# EAGLE design lichten (EAGLE 6.3)
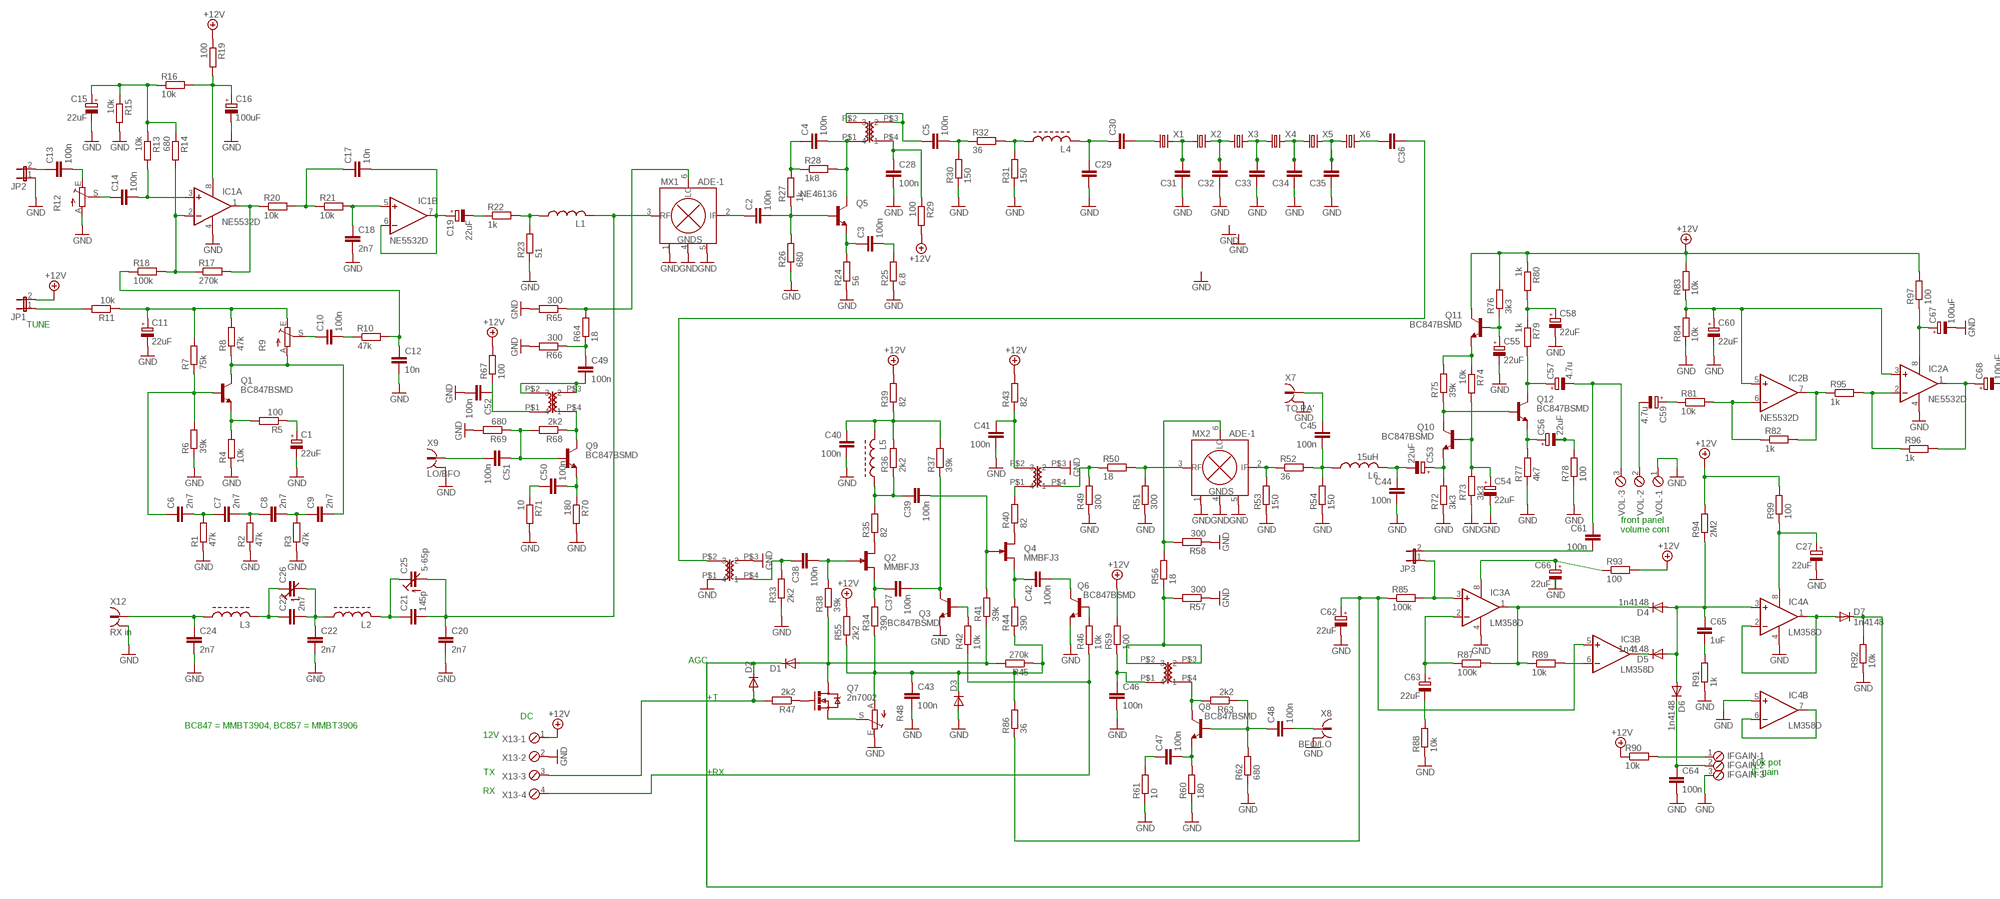
[diagram p0: schematic, sheet 1, part 1 of 2]
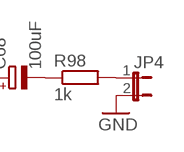
[diagram p1: schematic, sheet 1, part 2 of 2]

## Parts
C1  22uF  CPOL-EUB  [PANASONIC_B]
C2  100n  C-EUC1206K  [C1206K]
C3  100n  C-EUC1206K  [C1206K]
C4  100n  C-EUC1206K  [C1206K]
C5  100n  C-EUC1206K  [C1206K]
C6  2n7  C-EUC1206K  [C1206K]
C7  2n7  C-EUC1206K  [C1206K]
C8  2n7  C-EUC1206K  [C1206K]
C9  2n7  C-EUC1206K  [C1206K]
C10  100n  C-EUC1206K  [C1206K]
C11  22uF  CPOL-EUB  [PANASONIC_B]
C12  10n  C-EUC1206K  [C1206K]
C13  100n  C-EUC1206K  [C1206K]
C14  100n  C-EUC1206K  [C1206K]
C15  22uF  CPOL-EUB  [PANASONIC_B]
C16  100uF  CPOL-EUB  [PANASONIC_B]
C17  10n  C-EUC1206K  [C1206K]
C18  2n7  C-EUC1206K  [C1206K]
C19  22uF  CPOL-EUB  [PANASONIC_B]
C20  2n7  C-EUC1206K  [C1206K]
C21  145p  C-EUC1206K  [C1206K]
C22  2n7  C-EUC1206K  [C1206K]
C23  2n7  C-EUC1206K  [C1206K]
C24  2n7  C-EUC1206K  [C1206K]
C25  5-65p  C-TRIMM3050.505  [CTRIM3050.505]
C26  C-TRIMM3050.505  [CTRIM3050.505]
C27  22uF  CPOL-EUB  [PANASONIC_B]
C28  100n  C-EUC1206K  [C1206K]
C29  C-EUC1206K  [C1206K]
C30  C-EUC1206K  [C1206K]
C31  C-EUC1206K  [C1206K]
C32  C-EUC1206K  [C1206K]
C33  C-EUC1206K  [C1206K]
C34  C-EUC1206K  [C1206K]
C35  C-EUC1206K  [C1206K]
C36  C-EUC1206K  [C1206K]
C37  100n  C-EUC1206K  [C1206K]
C38  100n  C-EUC1206K  [C1206K]
C39  100n  C-EUC1206K  [C1206K]
C40  100n  C-EUC1206K  [C1206K]
C41  100n  C-EUC1206K  [C1206K]
C42  100n  C-EUC1206K  [C1206K]
C43  100n  C-EUC1206K  [C1206K]
C44  100n  C-EUC1206K  [C1206K]
C45  100n  C-EUC1206K  [C1206K]
C46  100n  C-EUC1206K  [C1206K]
C47  100n  C-EUC1206K  [C1206K]
C48  100n  C-EUC1206K  [C1206K]
C49  100n  C-EUC1206K  [C1206K]
C50  100n  C-EUC1206K  [C1206K]
C51  100n  C-EUC1206K  [C1206K]
C52  100n  C-EUC1206K  [C1206K]
C53  22uF  CPOL-EUB  [PANASONIC_B]
C54  22uF  CPOL-EUB  [PANASONIC_B]
C55  22uF  CPOL-EUB  [PANASONIC_B]
C56  22uF  CPOL-EUB  [PANASONIC_B]
C57  4.7u  CPOL-EUB  [PANASONIC_B]
C58  22uF  CPOL-EUB  [PANASONIC_B]
C59  4.7u  CPOL-EUB  [PANASONIC_B]
C60  22uF  CPOL-EUB  [PANASONIC_B]
C61  100n  C-EUC1206K  [C1206K]
C62  22uF  CPOL-EUB  [PANASONIC_B]
C63  22uF  CPOL-EUB  [PANASONIC_B]
C64  100n  C-EUC1206K  [C1206K]
C65  1uF  C-EUC1206K  [C1206K]
C66  22uF  CPOL-EUB  [PANASONIC_B]
C67  100uF  CPOL-EUB  [PANASONIC_B]
C68  100uF  CPOL-EUB  [PANASONIC_B]
D1  DIODE-SOD80C  [SOD80C]
D2  DIODE-SOD80C  [SOD80C]
D3  DIODE-SOD80C  [SOD80C]
D4  1n4148  DIODE-SOD80C  [SOD80C]
D5  1n4148  DIODE-SOD80C  [SOD80C]
D6  1n4148  DIODE-SOD80C  [SOD80C]
D7  1n4148  DIODE-SOD80C  [SOD80C]
IC1  NE5532D  [SO08]
IC2  NE5532D  [SO08]
IC3  LM358D  [SO08]
IC4  LM358D  [SO08]
IFGAIN  MPT3  [3POL254]
JP1  JP1E  [JP1]
JP2  JP1E  [JP1]
JP3  JP1E  [JP1]
JP4  JP1E  [JP1]
L1  L-US6000-XXX-RC  [6000-XXXX-RC]
L2  L-T37-UP  [L-T37-UP]
L3  L-T37-UP  [L-T37-UP]
L4  L-T37-UP  [L-T37-UP]
L5  L-T37-UP  [L-T37-UP]
L6  15uH  L-US6000-XXX-RC  [6000-XXXX-RC]
MX1  ADE-1  [CD636]
MX2  ADE-1  [CD636]
Q1  BC847BSMD  [SOT23]
Q2  MMBFJ3  [SOT23]
Q3  BC847BSMD  [SOT23]
Q4  MMBFJ3  [SOT23]
Q5  NE46136  -NPN-SOT89-BCE  [SOT89-BCE]
Q6  BC847BSMD  [SOT23]
Q7  2n7002  MOSFET-NCHANNELBSS123LT1G  [SOT23]
Q8  BC847BSMD  [SOT23]
Q9  BC847BSMD  [SOT23]
Q10  BC847BSMD  [SOT23]
Q11  BC847BSMD  [SOT23]
Q12  BC847BSMD  [SOT23]
R1  47k  R-EU_M1206  [M1206]
R2  47k  R-EU_M1206  [M1206]
R3  47k  R-EU_M1206  [M1206]
R4  10k  R-EU_M1206  [M1206]
R5  100  R-EU_M1206  [M1206]
R6  39k  R-EU_M1206  [M1206]
R7  75k  R-EU_M1206  [M1206]
R8  47k  R-EU_M1206  [M1206]
R9  TRIM_EU-B25P  [B25P]
R10  47k  R-EU_M1206  [M1206]
R11  10k  R-EU_M1206  [M1206]
R12  TRIM_EU-B25P  [B25P]
R13  10k  R-EU_M1206  [M1206]
R14  680  R-EU_M1206  [M1206]
R15  10k  R-EU_M1206  [M1206]
R16  10k  R-EU_M1206  [M1206]
R17  270k  R-EU_M1206  [M1206]
R18  100k  R-EU_M1206  [M1206]
R19  100  R-EU_M1206  [M1206]
R20  10k  R-EU_M1206  [M1206]
R21  10k  R-EU_M1206  [M1206]
R22  1k  R-EU_M1206  [M1206]
R23  51  R-EU_M1206  [M1206]
R24  56  R-EU_M1206  [M1206]
R25  6.8  R-EU_M1206  [M1206]
R26  680  R-EU_M1206  [M1206]
R27  1k  R-EU_M1206  [M1206]
R28  1k8  R-EU_M1206  [M1206]
R29  100  R-EU_M1206  [M1206]
R30  150  R-EU_M1206  [M1206]
R31  150  R-EU_M1206  [M1206]
R32  36  R-EU_M1206  [M1206]
R33  2k2  R-EU_M1206  [M1206]
R34  390  R-EU_M1206  [M1206]
R35  82  R-EU_M1206  [M1206]
R36  2k2  R-EU_M1206  [M1206]
R37  39k  R-EU_M1206  [M1206]
R38  39k  R-EU_M1206  [M1206]
R39  82  R-EU_M1206  [M1206]
R40  82  R-EU_M1206  [M1206]
R41  39k  R-EU_M1206  [M1206]
R42  10k  R-EU_M1206  [M1206]
R43  82  R-EU_M1206  [M1206]
R44  390  R-EU_M1206  [M1206]
R45  270k  R-EU_M1206  [M1206]
R46  10k  R-EU_M1206  [M1206]
R47  2k2  R-EU_M1206  [M1206]
R48  TRIM_EU-B25P  [B25P]
R49  300  R-EU_M1206  [M1206]
R50  18  R-EU_M1206  [M1206]
R51  300  R-EU_M1206  [M1206]
R52  36  R-EU_M1206  [M1206]
R53  150  R-EU_M1206  [M1206]
R54  150  R-EU_M1206  [M1206]
R55  2k2  R-EU_M1206  [M1206]
R56  18  R-EU_M1206  [M1206]
R57  300  R-EU_M1206  [M1206]
R58  300  R-EU_M1206  [M1206]
R59  100  R-EU_M1206  [M1206]
R60  180  R-EU_M1206  [M1206]
R61  10  R-EU_M1206  [M1206]
R62  680  R-EU_M1206  [M1206]
R63  2k2  R-EU_M1206  [M1206]
R64  18  R-EU_M1206  [M1206]
R65  300  R-EU_M1206  [M1206]
R66  300  R-EU_M1206  [M1206]
R67  100  R-EU_M1206  [M1206]
R68  2k2  R-EU_M1206  [M1206]
R69  680  R-EU_M1206  [M1206]
R70  180  R-EU_M1206  [M1206]
R71  10  R-EU_M1206  [M1206]
R72  3k3  R-EU_M1206  [M1206]
R73  3k3  R-EU_M1206  [M1206]
R74  10k  R-EU_M1206  [M1206]
R75  39k  R-EU_M1206  [M1206]
R76  3k3  R-EU_M1206  [M1206]
R77  4k7  R-EU_M1206  [M1206]
R78  100  R-EU_M1206  [M1206]
R79  1k  R-EU_M1206  [M1206]
R80  1k  R-EU_M1206  [M1206]
R81  10k  R-EU_M1206  [M1206]
R82  1k  R-EU_M1206  [M1206]
R83  10k  R-EU_M1206  [M1206]
R84  10k  R-EU_M1206  [M1206]
R85  100k  R-EU_M1206  [M1206]
R86  36  R-EU_M1206  [M1206]
R87  100k  R-EU_M1206  [M1206]
R88  10k  R-EU_M1206  [M1206]
R89  10k  R-EU_M1206  [M1206]
R90  10k  R-EU_M1206  [M1206]
R91  1k  R-EU_M1206  [M1206]
R92  10k  R-EU_M1206  [M1206]
R93  100  R-EU_M1206  [M1206]
R94  2M2  R-EU_M1206  [M1206]
R95  1k  R-EU_M1206  [M1206]
R96  1k  R-EU_M1206  [M1206]
R97  100  R-EU_M1206  [M1206]
R98  1k  R-EU_M1206  [M1206]
R99  100  R-EU_M1206  [M1206]
TR1  FT2402_TRAFO  [2402_TRAFO]
TR2  FT2402_TRAFO  [2402_TRAFO]
TR3  FT2402_TRAFO  [2402_TRAFO]
TR4  FT2402_TRAFO  [2402_TRAFO]
TR5  FT2402_TRAFO  [2402_TRAFO]
VOL  MPT3  [3POL254]
X1  CRYSTALHC49S  [HC49/S]
X2  CRYSTALHC49S  [HC49/S]
X3  CRYSTALHC49S  [HC49/S]
X4  CRYSTALHC49S  [HC49/S]
X5  CRYSTALHC49S  [HC49/S]
X6  CRYSTALHC49S  [HC49/S]
X7  TO PA'  ST-SMB-V  [ST-SMB-V]
X8  BFO/LO  ST-SMB-V  [ST-SMB-V]
X9  LO/BFO  ST-SMB-V  [ST-SMB-V]
X12  RX in  ST-SMB-V  [ST-SMB-V]
X13  MPT4  [4POL254]

## Nets
+12V: JP1.2 Q11.3(C) R19.1 R29.2 R39.2 R43.2 R55.2 R59.2 R67.2 R76.2 R80.1 R83.2 R90.1 R93.2 R94.2 R97.2 R99.2 X13.1
GND: C1.- C11.- C12.2 C15.- C16.- C18.2 C20.2 C22.2 C24.2 C27.- C28.2 C29.2 C31.1 C32.1 C33.1 C34.1 C35.1 C40.2 C41.2 C43.2 C44.2 C46.2 C52.2 C54.- C55.- C58.- C60.- C62.- C64.2 C66.- C67.- D3.A IC1.4(P:V-) IC2.4(P:V-) IC3.4(P:V-) IC4.4(P:V-) IC4.5(B:+IN) IFGAIN.3 JP2.1 JP4.2 MX1.1(GND) MX1.4(GND) MX1.5(GND) MX2.1(GND) MX2.4(GND) MX2.5(GND) Q3.2(E) Q6.2(E) R1.1 R2.1 R3.1 R4.1 R6.1 R12.A R15.2 R23.1 R24.1 R25.1 R26.1 R30.1 R31.1 R33.1 R48.E R49.1 R51.1 R53.1 R54.1 R57.1 R58.1 R60.1 R61.1 R62.1 R65.2 R66.2 R69.2 R70.2 R71.2 R72.1 R73.1 R77.1 R78.1 R84.1 R88.1 R91.1 R92.1 TR2.P$1 TR2.P$3 TR3.P$3 VOL.1 X7.2 X7.3 X7.4 X7.5 X8.2 X8.3 X8.4 X8.5 X9.2 X9.3 X9.4 X9.5 X12.2 X12.3 X12.4 X12.5 X13.2
N$1: C20.1 C21.2 C25.2(A) L1.2 MX1.3(RF)
N$2: C21.1 C25.1(E) L2.2
N$3: C22.1 C23.2 C26.2(A) L2.1
N$4: Q1.2(E) R4.2 R5.2
N$5: C1.+ R5.1
N$6: C9.2 Q1.3(C) R8.1 R9.A
N$7: C8.2 C9.1 R3.2
N$8: C7.2 C8.1 R2.2
N$9: C6.2 C7.1 R1.2
N$10: C6.1 Q1.1(B) R6.2 R7.1
N$11: C11.+ R7.2 R8.2 R9.E R11.1
N$12: C10.1 R9.S
N$13: C10.2 R10.1
N$14: C14.1 R12.S
N$15: JP1.1 R11.2
N$16: C12.1 R10.2 R18.1
N$17: C13.2 R12.E
N$18: C14.2 IC1.3(A:+IN) R13.2
N$19: C15.+ R13.1 R14.1 R15.1 R16.1
N$20: IC1.2(A:-IN) R14.2 R17.1 R18.2
N$21: C23.1 C26.1(E) L3.2
N$22: IC1.1(A:OUT) R17.2 R20.1
N$23: C30.2 X1.1
N$24: C13.1 JP2.2
N$25: C24.1 L3.1 X12.1
N$26: C2.1 MX1.2(IF)
N$27: C16.+ IC1.8(P:V+) R16.2 R19.2
N$28: C17.1 R20.2 R21.1
N$29: C18.1 IC1.5(B:+IN) R21.2
N$30: C17.2 C19.+ IC1.6(B:-IN) IC1.7(B:OUT)
N$31: C2.2 Q5.B R26.2 R27.1
N$32: C19.- R22.1
N$33: L1.1 R22.2 R23.2
N$34: C3.1 Q5.E R24.2
N$35: C4.2 Q5.C R28.2 TR1.P$1
N$36: C4.1 R27.2 R28.1
N$37: C5.1 TR1.P$2 TR1.P$3
N$38: C3.2 R25.2
N$39: C28.1 R29.1 TR1.P$4
N$40: C5.2 R30.2 R32.1
N$41: L4.1 R31.2 R32.2
N$42: C29.1 C30.1 L4.2
N$43: C31.2 X1.2 X2.1
N$44: C32.2 X2.2 X3.1
N$45: C33.2 X3.2 X4.1
N$46: C34.2 X4.2 X5.1
N$47: C35.2 X5.2 X6.1
N$48: C38.1 R33.2 TR2.P$4
N$49: C36.2 X6.2
N$50: C37.1 Q2.2(S) R34.2
N$51: Q2.1(D) R35.1
N$52: C39.1 L5.1 R35.2 R36.1
N$53: C38.2 Q2.3(G) R38.2
N$54: C40.1 L5.2 R36.2 R37.2 R39.1
N$55: C37.2 Q3.3(C) R37.1
N$56: C36.1 TR2.P$2
N$57: C39.2 Q4.3(G) R41.2
N$58: Q4.1(D) R40.1
N$59: Q3.1(B) R42.2
N$60: D1.A Q7.3(D) R38.1 R41.1 R45.2
N$61: R40.2 TR3.P$1
N$62: C41.1 R43.1 TR3.P$2
N$63: C42.1 Q4.2(S) R44.2
N$64: C42.2 Q6.3(C)
N$65: C68.+ IC2.1(A:OUT) R96.2
N$66: C43.1 D3.C R34.1 R44.1 R45.1 R48.A R55.1 R86.2
N$67: Q6.1(B) R46.2
N$68: R42.1 R46.1 X13.4
N$69: Q7.1(G) R47.1
N$70: D2.A R47.2 X13.3
N$71: Q7.2(S) R48.S
N$72: R49.2 R50.1 TR3.P$4
N$73: MX2.3(RF) R50.2 R51.2
N$74: MX2.2(IF) R52.1 R53.2
N$75: C45.2 L6.1 R52.2 R54.2
N$76: C44.1 C53.- L6.2
N$77: C45.1 X7.1
N$78: C54.+ Q10.1(B) R73.2 R74.2
N$79: MX2.6(LO) R56.2 R58.2
N$80: R56.1 R57.2 TR4.P$2 TR4.P$3
N$81: Q8.3(C) R63.2 TR4.P$4
N$82: C46.1 R59.1 TR4.P$1
N$83: C47.2 Q8.2(E) R60.2
N$84: C48.1 Q8.1(B) R62.2 R63.1
N$85: C47.1 R61.2
N$86: C48.2 X8.1
N$87: Q9.3(C) R68.1 TR5.P$4
N$88: C49.2 TR5.P$2 TR5.P$3
N$89: C49.1 R64.1 R66.1
N$90: MX1.6(LO) R64.2 R65.1
N$91: C52.1 R67.1 TR5.P$1
N$92: C51.1 Q9.1(B) R68.2 R69.1
N$93: C50.1 R71.1
N$94: C50.2 Q9.2(E) R70.1
N$95: C51.2 X9.1
N$96: C53.+ Q10.2(E) R72.2
N$97: C56.- R78.2
N$98: Q10.3(C) Q12.1(B) R75.1
N$99: Q11.2(E) R74.1 R75.2
N$100: C55.+ Q11.1(B) R76.1
N$101: C67.+ IC2.8(P:V+) R97.1
N$102: C56.+ Q12.2(E) R77.2
N$103: C57.+ Q12.3(C) R79.2
N$104: C58.+ R79.1 R80.2
N$105: C57.- C61.1 VOL.3
N$106: IC2.6(B:-IN) R81.2 R82.1
N$107: C59.- VOL.2
N$108: IC2.7(B:OUT) R82.2 R95.1
N$109: C59.+ R81.1
N$110: C60.+ IC2.3(A:+IN) IC2.5(B:+IN) R83.1 R84.2
N$111: C62.+ IC3.5(B:+IN) R85.1 R86.1
N$112: C63.- R88.2
N$113: C61.2 JP3.2
N$114: C63.+ IC3.2(A:-IN) R87.1
N$115: D4.C IC3.1(A:OUT) R87.2 R89.1
N$116: IC3.6(B:-IN) R89.2
N$117: C68.- R98.1
N$118: D5.C IC3.7(B:OUT)
N$119: C65.1 D4.A D5.A D6.A IC4.3(A:+IN) R94.1
N$120: IFGAIN.1 R90.2
N$121: C64.1 D6.C IFGAIN.2
N$122: C65.2 R91.2
N$123: D7.A IC4.1(A:OUT) IC4.2(A:-IN)
N$124: D1.C D2.C D7.C R92.2
N$125: C66.+ R93.1
N$126: IC4.6(B:-IN) IC4.7(B:OUT)
N$128: IC2.2(A:-IN) R95.2 R96.1
N$129: IC3.3(A:+IN) JP3.1 R85.2
N$133: JP4.1 R98.2
N$134: IC3.8(P:V+)
N$135: C27.+ IC4.8(P:V+) R99.1

## Notes on the sheet
- TUNE
- front panel
  volume cont
- AGC
- +T
- DC
- BC847 = MMBT3904, BC857 = MMBT3906
- 12V
- TX | +RX
- 10k pot
  IF gain
- RX

## Library data of the parts
C1 C11 C15 C16 C19 C27 C53-C60 C62 C63 C66-C68 = rcl:CPOL-EU: POLARIZED CAPACITOR, European symbol
C2-C10 C12-C14 C17 C18 C20-C24 C28-C52 C61 C64 C65 = rcl:C-EU: CAPACITOR, European symbol
C25 C26 = rcl:C-TRIMM: Trimm capacitor
D1-D7 = diode:DIODE-: DIODE
IC1 IC2 = linear:NE5532: AUDIO AMPLIFIER
IC3 IC4 = linear:LM358: OP AMP also LM158; LM258; LM2904 Source: http://cache.national.com/ds/LM/LM158.pdf
IFGAIN VOL = con-phoenix-254:MPT3: PHOENIX CONNECTOR; OC_FARNELL: unknown; OC_NEWARK: unknown
JP1-JP4 = jumper:JP1E: JUMPER
L1 L6 = rcl:L-US: INDUCTOR, American symbol
L2-L5 = yhf_spec:L-T37-UP
MX1 MX2 = minickts:ADE-1: ADE-1 & ADE-1+ Level 7 Mixer, 0.5 - 500 MHz
Q1 Q3 Q6 Q8-Q12 = transistor-npn:BC847*: NPN Transistor
Q2 Q4 = transistor-small-signal:MMBFJ3*: N-Channel RF Amplifier Source: http://www.fairchildsemi.com/pf/J3/J310.html
Q5 = transistor:*-NPN-: NPN Transistror BF959 corrected 2008.03.06
Q7 = SparkFun-DiscreteSemi:MOSFET-NCHANNEL: Common NMOSFET Parts MFG P/N Store ID Prod ID FDD8780 TRANS-09984 SI7820DN TRANS-11055 FDS6630A IC-08089 2N7002PW TRANS-11151 FQP30N06L COM-10213 TRANS-10060 BSS123LT1G TRANS-08345 BSS138 TRANS-00830 BS170 2N7000; PROD_ID: TRANS-08345
R1-R8 R10 R11 R13-R47 R49-R99 = rcl:R-EU_: RESISTOR, European symbol
R9 R12 R48 = pot:TRIM_EU-: POTENTIOMETER
TR1-TR5 = ref-packages:FT2402_TRAFO
X1-X6 = crystal:CRYSTAL: CRYSTAL; OC_FARNELL: 1667008; OC_NEWARK: unknown
X7-X9 X12 = con-coax:ST-SMB-V: MALE SMB CONNECTOR Radiall distributor RS 193-8855G7; OC_FARNELL: unknown; OC_NEWARK: unknown
X13 = con-phoenix-254:MPT4: PHOENIX CONNECTOR; OC_FARNELL: unknown; OC_NEWARK: unknown

## Board
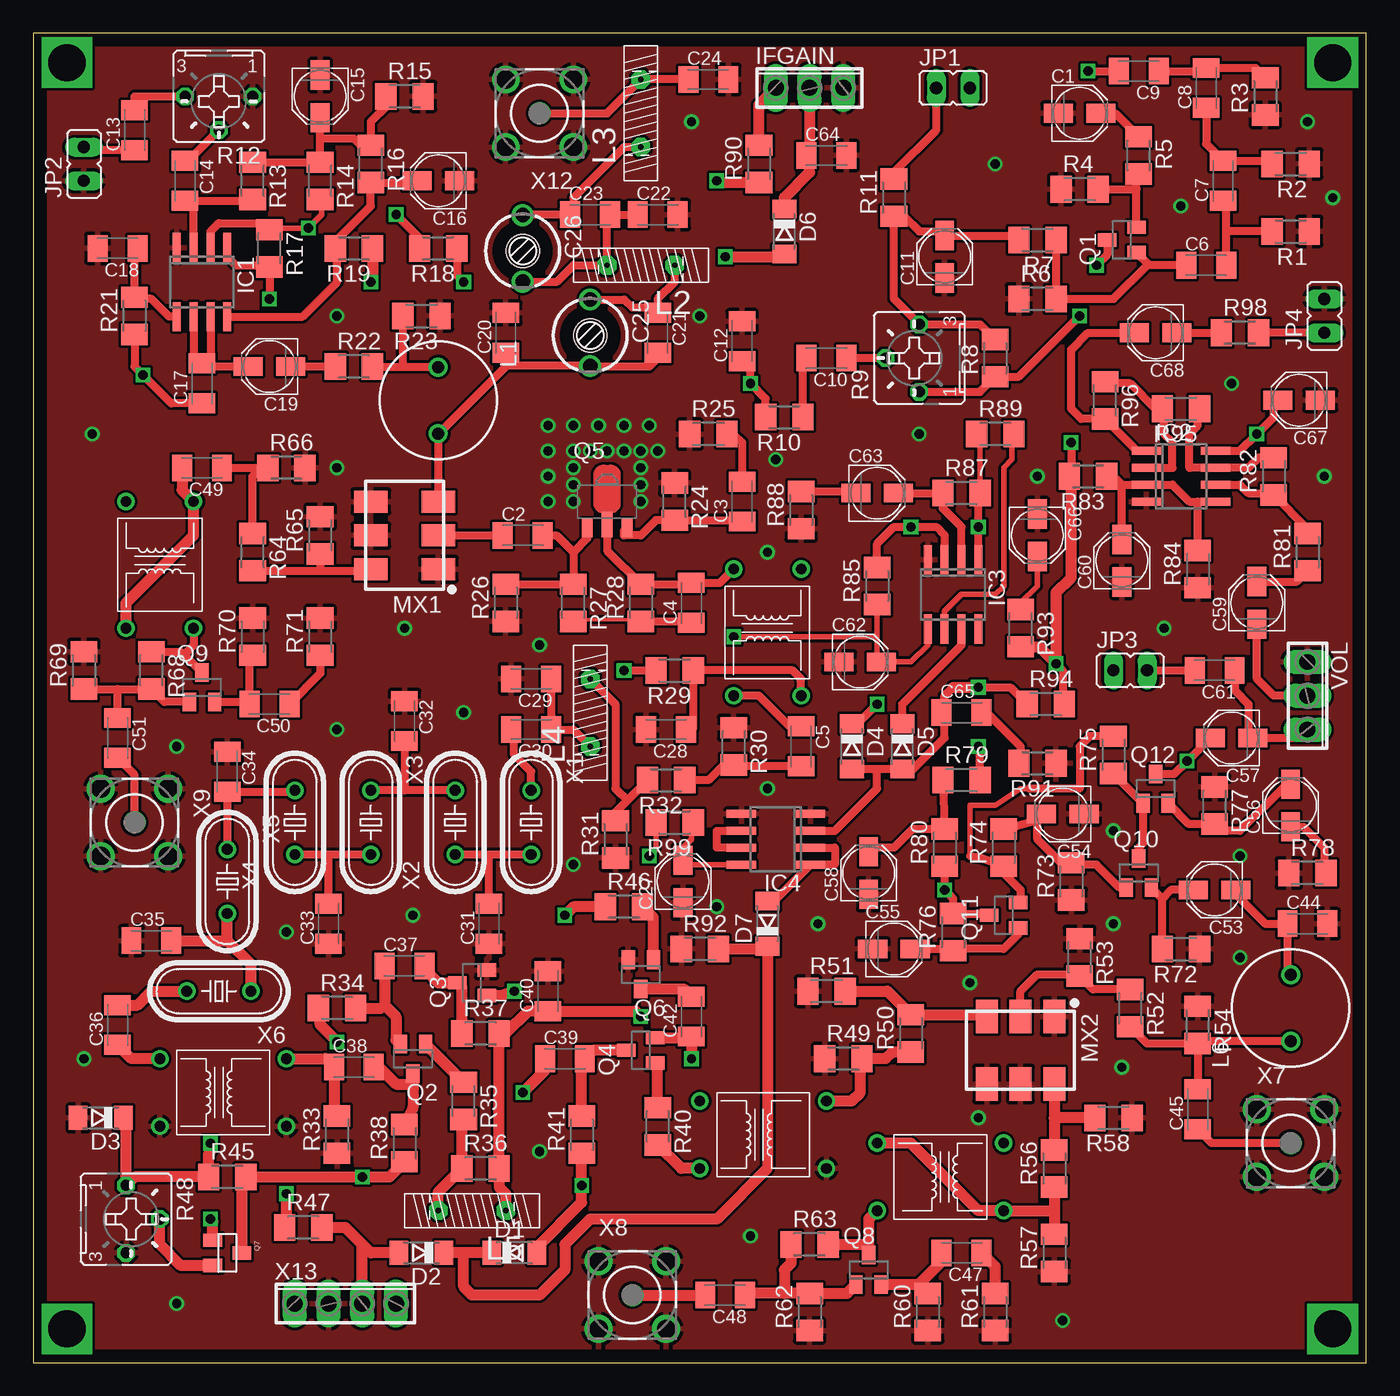
[diagram p2: board, top side]
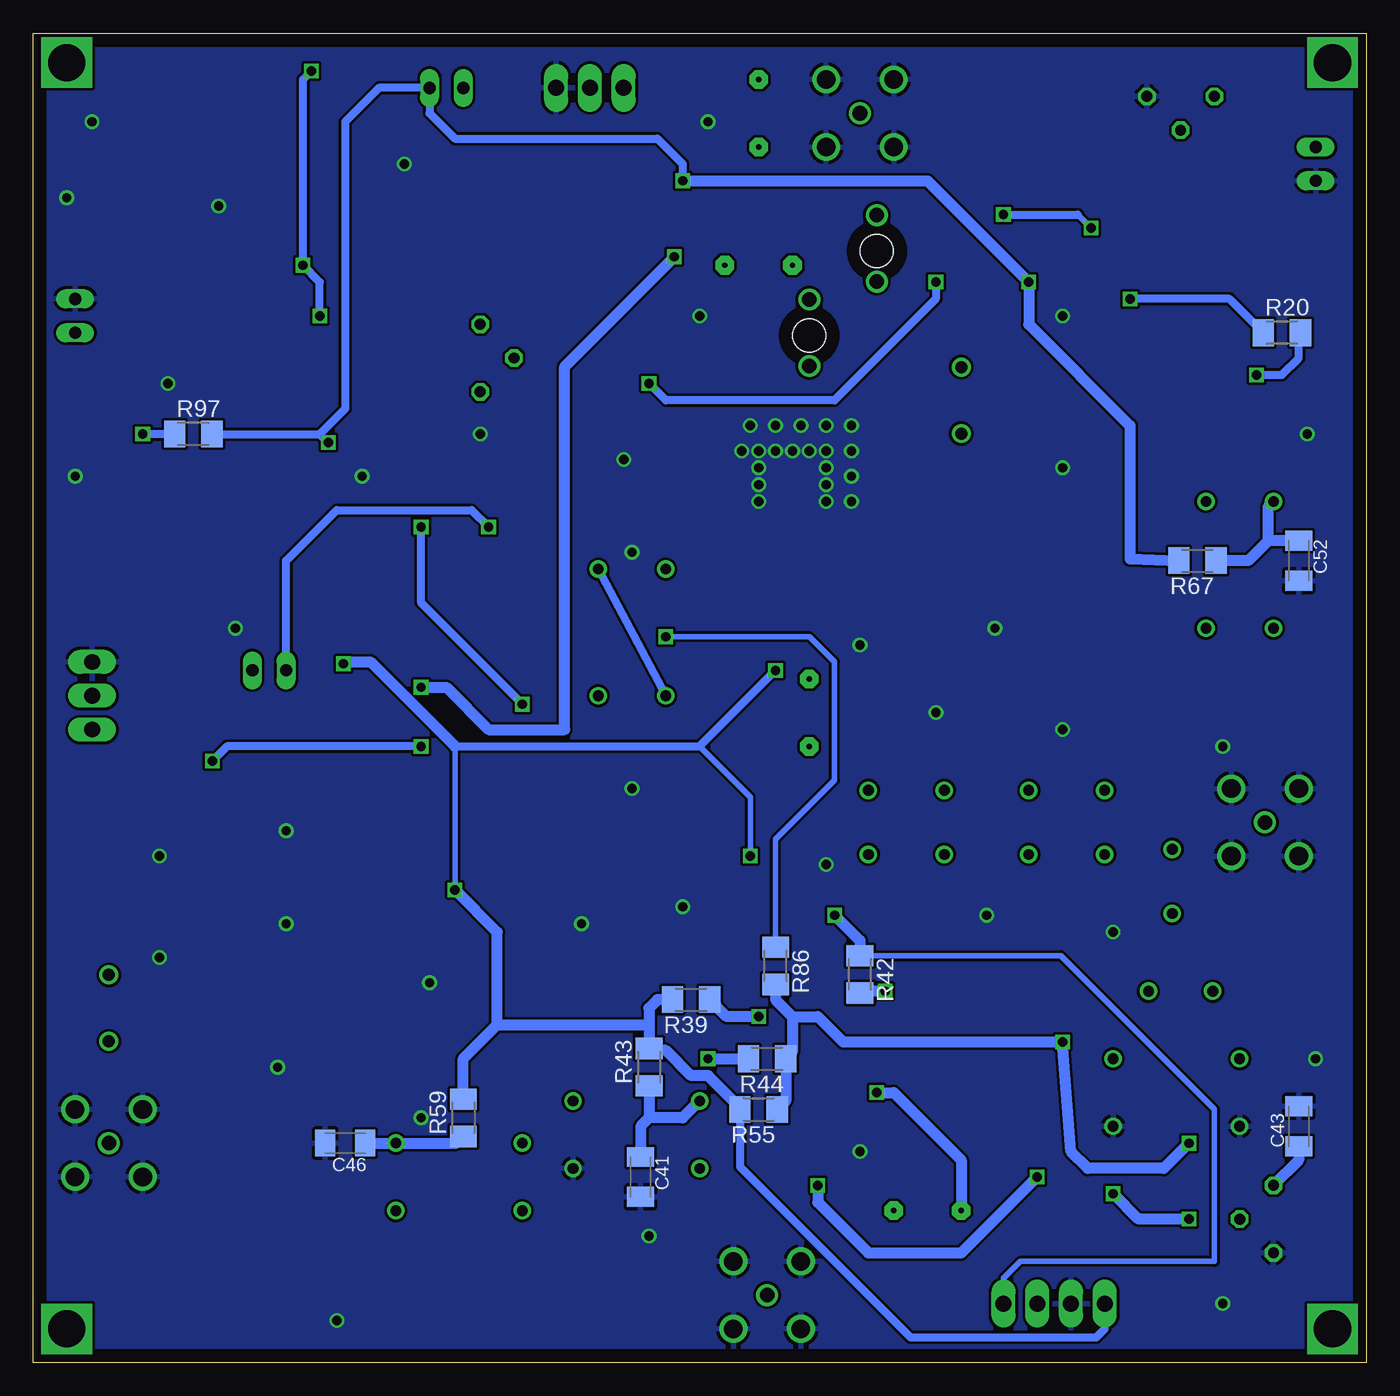
[diagram p3: board, bottom side, seen from below]

Size 100.31 x 100 mm. Coordinates in mm from the lower left corner, seen from the top.
Outline: 0,0 100.31,0 100.31,100 0,100 0,0
Copper layers (1*16): Top 0.035mm / dielectric 1.5mm / Bottom 0.035mm
Design rules "default": minimum track width 10mil, minimum drill 24mil, track to track 8mil, track to pad 8mil, pad to pad 8mil, via to via 8mil, smd to smd 8mil, copper to edge 40mil, drill to drill 8mil, minimum pad ring 10mil, minimum via ring 8mil, stop-mask expansion 4mil, vias tented up to drill 0mil, thermal gap 10mil

### Footprints (pad centres in the part's own frame; a part is rotated, then mirrored left to right if it is on the bottom)
PANASONIC_B = smd 2.2 x 1.4: + 1.6,0; - -1.6,0
C1206K = smd 1.5 x 2: 1 -1.5,0; 2 1.5,0
CTRIM3050.505 = drill 1.1: 1 -2.5,0; 2 2.5,0 | hole 2.5: 0.2,0
SOD80C = smd 1.4 x 1.8: A 1.7,0; C -1.7,0
SO08 = smd 0.6 x 2.2: 1 -1.905,-2.6; 2 -0.635,-2.6; 3 0.635,-2.6; 4 1.905,-2.6; 5 1.905,2.6; 6 0.635,2.6; 7 -0.635,2.6; 8 -1.905,2.6
3POL254 = drill 1.2 long: 1 -2.54,0; 2 0,0; 3 2.54,0
JP1 = drill 0.914 long: 1 0,-1.27; 2 0,1.27
6000-XXXX-RC = drill 0.9 pad 1.422: 1 -2.5,0; 2 2.5,0
L-T37-UP = drill 0.406 pad 1.397 octagon: 1 2.54,0; 2 -2.54,0
CD636 = smd 1.651 x 2.54: 1 -2.54,-2.54; 2 0,-2.54; 3 2.54,-2.54; 4 2.54,2.54; 5 0,2.54; 6 -2.54,2.54
SOT23 = smd 1 x 1.4: 1 -0.95,-1.1; 2 0.95,-1.1; 3 0,1.1
SOT89-BCE = smd 0.8 x 1.4: B -1.499,-1.981; E 1.499,-1.981 | smd 0.8 x 1.9: C 0,-1.727
M1206 = smd 1.6 x 2: 1 -1.4,0; 2 1.4,0
B25P = drill 0.813 octagon: A -2.54,0; E 2.54,0; S 0,2.54
2402_TRAFO = drill 0.8: P$1 -1.27,0.635; P$2 -1.27,5.715; P$3 8.255,0.635; P$4 8.255,5.715
HC49/S = drill 0.813: 1 -2.413,0; 2 2.413,0
ST-SMB-V = drill 1.1: 1 0,0 | drill 1.4: 2 -2.54,2.54; 3 2.54,2.54; 4 2.54,-2.54; 5 -2.54,-2.54
4POL254 = drill 1.2 long: 1 -3.81,0; 2 -1.27,0; 3 1.27,0; 4 3.81,0

### Placement (x,y rotation side)
C1  78.74,93.98 0 top
C2  36.83,62.23 0 top
C3  53.34,64.77 90 top
C4  49.53,57.15 90 top
C5  57.78,46.35 270 top
C6  88.27,82.55 0 top
C7  89.53,88.9 90 top
C8  88.27,95.89 90 top
C9  83.19,97.16 180 top
C10  59.69,75.56 180 top
C11  68.58,83.19 90 top
C12  53.34,76.83 90 top
C13  7.62,92.71 90 top
C14  11.43,88.9 270 top
C15  21.59,95.25 270 top
C16  30.48,88.9 180 top
C17  12.7,73.66 90 top
C18  6.35,83.82 180 top
C19  17.78,74.93 180 top
C20  35.56,77.47 90 top
C21  46.99,77.47 270 top
C22  46.99,86.36 0 top
C23  41.91,86.36 0 top
C24  50.8,96.52 0 top
C25  41.91,77.47 270 top
C26  36.83,83.82 270 top
C27  48.9,36.2 90 top
C28  47.62,47.62 180 top
C29  37.47,51.44 180 top
C30  37.47,47.62 180 top
C31  34.29,33.02 90 top
C32  27.94,48.26 270 top
C33  22.23,33.02 90 top
C34  14.61,44.45 270 top
C35  8.89,31.75 0 top
C36  6.35,25.4 90 top
C37  27.94,29.84 0 top
C38  24.13,22.23 0 top
C39  40.01,22.86 0 top
C40  38.73,27.94 90 top
C41  54.61,13.97 270 bottom
C42  49.53,26.04 90 top
C43  5.08,17.78 90 bottom
C44  95.89,33.02 0 top
C45  87.63,19.05 90 top
C46  76.83,16.51 180 bottom
C47  69.85,8.26 180 top
C48  52.07,5.08 180 top
C49  12.7,67.31 180 top
C50  17.78,49.53 180 top
C51  6.35,46.99 270 top
C52  5.08,60.33 270 bottom
C53  88.9,35.56 180 top
C54  77.47,41.27 180 top
C55  64.77,31.11 0 top
C56  94.61,41.91 90 top
C57  90.17,46.99 180 top
C58  62.87,36.83 90 top
C59  92.08,57.15 90 top
C60  81.92,60.33 90 top
C61  88.9,52.07 180 top
C62  62.23,52.7 0 top
C63  63.5,65.41 0 top
C64  59.69,90.81 0 top
C65  69.85,48.9 0 top
C66  75.56,62.23 270 top
C67  95.25,72.39 180 top
C68  84.45,77.47 180 top
D1  36.2,8.26 0 top
D2  29.21,8.26 180 top
D3  5.08,18.41 180 top
D4  61.59,46.35 270 top
D5  65.41,46.35 270 top
D6  56.52,85.09 270 top
D7  55.24,33.02 90 top
IC1  12.7,81.28 180 top
IC2  86.36,66.67 270 top
IC3  69.22,57.78 180 top
IC4  55.88,39.37 90 top
IFGAIN  58.42,95.89 0 top
JP1  69.22,95.89 270 top
JP2  3.81,90.17 0 top
JP3  82.55,52.07 270 top
JP4  97.16,78.74 0 top
L1  30.48,72.39 270 top
L2  45.72,82.55 180 top
L3  45.72,93.98 90 top
L4  41.91,48.9 90 top
L5  33.02,11.43 180 top
L6  94.61,26.67 90 top
MX1  27.94,62.23 90 top
MX2  74.3,23.5 180 top
Q1  81.92,84.45 90 top
Q2  28.57,22.86 180 top
Q3  33.02,28.57 90 top
Q4  45.72,23.5 90 top
Q5  43.18,64.77 0 top
Q6  45.72,29.21 180 top
Q7  14.61,8.26 270 top
Q8  62.87,6.99 0 top
Q9  12.7,50.8 0 top
Q10  83.19,36.83 0 top
Q11  73.03,33.66 90 top
Q12  84.45,43.18 0 top
R1  94.61,85.09 180 top
R2  94.61,90.17 180 top
R3  92.71,95.25 90 top
R4  78.74,88.27 0 top
R5  83.19,90.81 270 top
R6  75.56,80.01 0 top
R7  75.56,84.45 180 top
R8  72.39,75.56 90 top
R9  66.67,75.56 90 top
R10  56.52,71.12 180 top
R11  64.77,87.63 90 top
R12  13.97,95.25 180 top
R13  16.51,88.9 270 top
R14  21.59,88.9 270 top
R15  27.94,95.25 0 top
R16  25.4,90.17 270 top
R17  17.78,83.82 270 top
R18  30.48,83.82 180 top
R19  24.13,83.82 180 top
R20  6.35,77.47 0 bottom
R21  7.62,78.74 90 top
R22  24.13,74.93 0 top
R23  29.21,78.74 180 top
R24  48.26,64.77 270 top
R25  50.8,69.85 0 top
R26  35.56,57.15 90 top
R27  40.64,57.15 270 top
R28  45.72,57.15 90 top
R29  48.26,52.07 180 top
R30  52.7,46.35 270 top
R31  43.81,39.37 90 top
R32  47.62,43.81 180 top
R33  22.86,17.14 90 top
R34  22.86,26.67 0 top
R35  32.38,19.68 270 top
R36  33.66,14.61 0 top
R37  33.66,24.77 0 top
R38  27.94,16.51 90 top
R39  50.8,27.3 180 bottom
R40  46.99,17.78 270 top
R41  41.27,17.14 90 top
R42  38.1,29.21 270 bottom
R43  53.98,22.23 90 bottom
R44  45.09,22.86 180 bottom
R45  14.61,13.97 0 top
R46  44.45,34.29 0 top
R47  20.32,10.16 0 top
R48  6.99,10.79 270 top
R49  60.96,22.86 0 top
R50  66.04,24.77 90 top
R51  59.69,27.94 0 top
R52  82.55,26.67 270 top
R53  78.74,30.48 270 top
R54  87.63,25.4 270 top
R55  45.72,19.05 180 bottom
R56  76.83,14.61 90 top
R57  76.83,8.26 90 top
R58  81.28,18.41 180 top
R59  67.94,18.41 90 bottom
R60  67.31,3.81 90 top
R61  72.39,3.81 90 top
R62  58.42,3.81 90 top
R63  58.42,8.89 0 top
R64  16.51,60.96 270 top
R65  21.59,62.23 90 top
R66  19.05,67.31 0 top
R67  12.7,60.33 180 bottom
R68  8.89,52.07 270 top
R69  3.81,52.07 90 top
R70  16.51,54.61 90 top
R71  21.59,54.61 90 top
R72  86.36,31.11 180 top
R73  78.11,36.2 90 top
R74  73.03,38.73 90 top
R75  81.28,45.72 90 top
R76  69.22,32.38 90 top
R77  88.9,41.91 270 top
R78  95.89,36.83 0 top
R79  69.85,43.81 0 top
R80  68.58,38.73 90 top
R81  95.89,60.96 90 top
R82  93.34,66.67 90 top
R83  79.38,66.67 180 top
R84  87.63,59.69 90 top
R85  63.5,58.42 90 top
R86  44.45,29.84 270 bottom
R87  69.85,65.41 0 top
R88  57.78,64.14 90 top
R89  72.39,69.85 0 top
R90  54.61,90.17 90 top
R91  75.56,45.09 180 top
R92  50.16,31.11 0 top
R93  74.3,55.24 270 top
R94  76.2,49.53 0 top
R95  86.36,71.75 180 top
R96  80.64,72.39 270 top
R97  88.27,69.85 0 bottom
R98  90.81,77.47 0 top
R99  48.26,40.64 180 top
TR1  52.07,58.42 270 top
TR2  10.79,17.14 0 top
TR3  51.44,13.97 0 top
TR4  71.75,17.14 180 top
TR5  6.35,63.5 270 top
VOL  95.89,50.16 270 top
X1  37.47,40.64 270 top
X2  31.75,40.64 90 top
X3  25.4,40.64 270 top
X4  19.68,40.64 90 top
X5  14.61,36.2 270 top
X6  13.97,27.94 180 top
X7  94.61,16.51 0 top
X8  45.09,5.08 0 top
X9  7.62,40.64 270 top
X12  38.1,93.98 180 top
X13  23.5,4.45 0 top

### Tracks (layer width: path | path; a pad name or v marks a point on that pad's centre or on a via)
+12V  (via drill 0.7)
  Top 0.406: R99.2 46.86,38.6 v46.35,38.1
  Top 0.61: Q11.3 71.16,33.78 R76.2 69.22,34.92 v68.58,35.56 R80.1 | v76.97,52.58 77.47,52.07 77.47,49.66 R94.2 | v78.11,69.22 78.11,66.81 R83.2 | v44.45,52.07 R29.2
  Top 0.813: R19.1 25.53,81.41 v25.4,81.28 | R90.1 51.56,88.77 v51.44,88.9 | R83.2 78.11,66.55 78.11,59.05 76.97,57.91 v76.97,52.58 76.83,52.7 75.69,53.84 R93.2
  Bottom 0.406: v68.58,35.56 68.58,46.35 | 76.83,52.7 v76.97,52.58 | v46.35,38.1 46.35,42.55 50.16,46.35
  Bottom 0.61: R97.2 78.74,69.85 | 78.74,69.85 v78.11,69.22 | 78.74,69.85 76.83,71.75 76.83,93.34 74.3,95.89 JP1.2 70.48,93.98 68.58,92.08 53.34,92.08 51.44,90.17 v51.44,88.9 | 68.58,46.35 50.16,46.35 v44.45,52.07 | R55.2 47.12,14.73 34.29,1.91 20.32,1.91 19.68,2.54 X13.1
  Bottom 0.813: R39.2 53.34,27.3 53.98,26.67 53.98,25.4 | 53.98,25.4 R43.2 53.84,23.5 52.7,23.5 50.8,21.59 49.53,21.59 47.12,19.18 R55.2 | R59.2 67.94,22.86 65.41,25.4 | 65.41,25.4 53.98,25.4 | 65.41,25.4 65.41,32.38 v68.58,35.56 | R67.2 17.78,60.45 17.78,70.48 25.4,78.11 v25.4,81.28 33.02,88.9 v51.44,88.9 | 76.83,52.7 74.93,52.7 68.58,46.35
GND  (via drill 0.7)
  other vias: 4.45,69.85 22.86,78.74 22.86,67.31 27.94,55.24 38.73,70.48 50.16,78.74 49.53,93.34 72.39,90.17 86.36,87 97.79,87.63 95.89,93.34 66.67,69.85 85.09,55.24 97.16,66.67 90.17,73.66 75.56,66.67 55.88,67.94 32.38,48.9 10.79,46.35 77.47,3.17 71.12,18.41 53.98,9.53 10.79,4.45 3.81,22.86 19.05,32.38 28.57,33.66 59.05,33.02 81.92,22.23 90.81,30.48 90.81,38.1 81.28,33.02 81.28,40.01 70.48,28.57 38.1,15.88 55.24,43.18 51.44,34.29 40.64,37.47 22.86,47.62 40.64,64.77 40.64,66.04 40.64,67.31 40.64,68.58 41.91,68.58 43.18,68.58 44.45,68.58 45.72,67.31 45.72,66.04 45.72,64.77 38.73,64.77 38.73,66.67 38.73,68.58 46.35,70.48 40.64,70.48 42.55,70.48 44.45,70.48 46.99,68.58 55.24,60.96 38.1,53.98 45.72,68.58
  pour Bottom: -2.54,101.6 102.87,101.6 102.87,-2.54 -2.54,-2.54
  pour Top: -3.81,104.14 102.87,103.5 102.87,-5.71 -3.81,-5.08
N$1
  Top 0.61: C21.2 46.99,75.56 46.35,74.93 41.95,74.93 C25.2 35.6,74.97 35.56,74.93 | 35.56,74.93 C20.1 | MX1.3 L1.2 30.52,69.89 35.56,74.93
N$2
  Top 0.61: C25.1 44.49,79.97 45.09,79.38 46.59,79.38 C21.1 46.99,80.01 48.26,81.28 L2.2
N$3
  Top 0.61: C22.1 C23.2 43.18,86.13 L2.1 40.64,82.55 39.41,81.32 C26.2
N$4
  Top 0.61: Q1.2 83.02,88.27 | 83.02,88.27 83.02,89.23 R5.2 | R4.2 83.02,88.27
N$5
  Top 0.61: C1.+ 81.41,93.98 R5.1
N$6  (via drill 0.7)
  Top 0.61: R9.A 71.25,73.03 R8.1 74.17,74.17 v78.74,78.74 | Q1.3 80.81,83.36 v80.01,82.55 | v79.38,97.16 C9.2
  Bottom 0.61: v79.38,97.16 80.01,96.52 v80.01,82.55 78.74,81.28 v78.74,78.74
N$7
  Top 0.61: C9.1 88.03,97.16 C8.2 91.97,97.39 R3.2
N$8
  Top 0.61: C8.1 88.27,91.67 C7.2 92.98,90.4 R2.2
N$9
  Top 0.61: C6.2 89.77,85.09 | 89.77,85.09 89.77,87.17 C7.1 | R1.2 89.77,85.09
N$10
  Top 0.61: C6.1 83.97,82.55 83.89,82.62 | 83.89,82.62 Q1.1 | 83.89,82.62 81.28,80.01 R6.2 R7.1
N$11
  Top 0.61: R8.2 71.25,78.11 R9.E 64.77,80.01 R11.1 65.53,86.23 66.67,85.09 68.28,85.09 C11.+ 73.83,84.78 R7.2
N$12
  Top 0.61: R9.S C10.1
N$13
  Top 0.61: R10.1 57.91,75.29 C10.2
N$14
  Top 0.61: C14.1 11.66,90.4 R12.S
N$15
  Top 0.61: R11.2 64.77,89.53 67.94,92.71 JP1.1
N$16  (via drill 0.7)
  Top 0.61: R18.1 31.88,81.78 v32.38,81.28 | C12.1 53.98,74.7 v53.98,73.66 55.12,72.52 R10.2
  Bottom 0.61: v32.38,81.28 32.38,80.01 40.01,72.39 52.7,72.39 v53.98,73.66
N$17
  Top 0.61: C13.2 7.62,95.25 R12.E
N$18
  Top 0.61: R13.2 16.41,87.4 C14.2 12.06,86.77 IC1.3
N$19
  Top 0.61: R13.1 R14.1 21.59,92.08 | 21.59,92.08 C15.+ | 21.59,92.08 24.13,92.08 24.64,91.57 R16.1 25.4,93.34 26.54,94.48 R15.1
N$20  (via drill 0.7)
  Top 0.406: R17.1 17.9,85.34 v20.7,85.34 21.72,86.36 21.72,87.37 R14.2
  Top 0.61: IC1.2 13.34,85.09 13.97,85.72 17.27,85.72 R17.1 | R18.2 29.08,84.58 v27.3,86.36
  Bottom 0.406: 21.72,86.36 v20.7,85.34
  Bottom 0.61: v27.3,86.36 21.72,86.36
N$21
  Top 0.61: L3.2 44.45,91.44 40.64,87.63 40.64,86.59 C23.1 36.87,86.36 C26.1
N$22  (via drill 0.7)
  Top 0.61: IC1.1 14.61,83.19 15.24,82.55 17.65,82.55 R17.2 v17.78,80.01
  Bottom 0.61: R20.1 10.29,80.01 v17.78,80.01
N$23
  Top 0.61: X1.1 37.47,44.45 36.2,45.72 36.2,47.4 C30.2
N$24
  Top 0.61: C13.1 3.81,91.21 JP2.2
N$25
  Top 0.61: X12.1 43.18,93.98 L3.1 C24.1
N$26
  Top 0.61: MX1.2 C2.1
N$27
  Top 0.61: IC1.8 20.26,78.68 22.86,81.28 22.86,83.69 R19.2 22.73,84.33 25.4,87 R16.2 28.75,88.77 C16.+
N$28  (via drill 0.7)
  Top 0.61: C17.1 10.39,72.16 v8.26,74.3 7.62,74.93 R21.1
  Bottom 0.61: v8.26,74.3 6.35,74.3 5.08,75.56 5.08,77.34 R20.2
N$29
  Top 0.61: C18.1 7.62,83.59 R21.2 7.75,80.01 8.89,80.01 10.22,78.68 IC1.5
N$30
  Top 0.61: IC1.6 12.06,75.8 C17.2 | IC1.7 13.34,75.8 C17.2 | C19.+ 12.93,74.93 C17.2
N$31
  Top 0.61: R26.2 R27.1 40.64,60.96 | Q5.B 41.68,62 40.64,60.96 | C2.2 39.37,62.23 40.64,60.96
N$32
  Top 0.61: R22.1 C19.-
N$33
  Top 0.61: R22.2 27.94,74.93 | 27.94,74.93 30.44,74.93 L1.1 | R23.2 27.81,75.06 27.94,74.93
N$34
  Top 0.61: C3.1 53.24,63.37 R24.2 46.86,63.37 45.72,62.23 44.45,62.23 44.45,62.56 Q5.E
N$35
  Top 0.61: Q5.C 43.18,61.09 R28.2 49.43,58.55 C4.2 51.66,58.65 TR1.P$1
N$36
  Top 0.254: R27.2 40.64,55.88 45.72,55.88 R28.1
  Top 0.61: R28.1 49.43,55.75 C4.1
N$37
  Top 0.61: C5.1 56.92,47.85 54.61,50.16 TR1.P$3
  Bottom 0.61: TR1.P$3 TR1.P$2
N$38
  Top 0.61: R25.2 52.7,69.85 53.34,69.22 C3.2
N$39
  Top 0.61: TR1.P$4 57.78,51.44 57.15,52.07 R29.1 49.66,47.73 C28.1
N$40
  Top 0.61: C5.2 52.8,44.85 R30.2 51.94,44.95 50.8,43.81 R32.1
N$41
  Top 0.61: R31.2 43.81,41.41 44.7,42.29 | 44.7,42.29 R32.2 | L4.1 43.81,49.53 43.81,43.18 44.7,42.29
N$42
  Top 0.61: L4.2 40.64,47.62 C30.1 C29.1
N$43
  Top 0.61: X2.1 34.29,38.23 | 34.29,38.23 X1.2 | C31.2 34.29,38.23
N$44
  Top 0.61: X2.2 27.94,43.05 | 27.94,43.05 X3.1 | C32.2 27.94,43.05
N$45
  Top 0.61: X4.1 22.23,38.23 | 22.23,38.23 X3.2 | C33.2 22.23,38.23
N$46
  Top 0.61: X5.1 C34.2 19.58,42.95 X4.2
N$47
  Top 0.813: X6.1 16.38,29.97 14.61,31.75 | 14.61,31.75 X5.2 | C35.2 14.61,31.75
N$48
  Top 0.813: TR2.P$4 22,22.86 C38.1 22.63,18.77 R33.2
N$49
  Top 0.813: C36.2 7.85,26.9 8.89,27.94 X6.2
N$50
  Top 0.813: C37.1 26.44,26.9 | 26.44,26.9 27.3,26.04 27.3,24.28 Q2.2 | R34.2 26.21,26.67 26.44,26.9
N$51
  Top 0.813: R35.1 32.38,21.1 Q2.1
N$52  (via drill 0.7)
  Top 0.813: L5.1 30.48,12.83 R36.1 32.26,18.16 R35.2 | C39.1 38.51,22 v36.83,20.32
  Bottom 0.813: v36.83,20.32 35.56,20.32 30.48,15.24 L5.1
N$53
  Top 0.813: Q2.3 28.57,20.95 | 28.57,20.95 28.57,19.18 R38.2 | C38.2 26.04,22.23 27.3,20.95 28.57,20.95
N$54  (via drill 0.7)
  Top 0.813: L5.2 35.56,12.7 35.05,13.21 R36.2 R37.2 35.56,24.77 37.23,26.44 C40.1 45.31,26.44 v45.72,26.04
  Bottom 0.813: v45.72,26.04 48.13,26.04 R39.1
N$55
  Top 0.813: C37.2 29.44,29.61 30.48,28.57 Q3.3 32.26,28.24 R37.1
N$56
  Top 0.813: TR2.P$2 7.39,22.86 C36.1
N$57
  Top 0.813: Q4.3 42.14,23.5 C39.2 41.27,22.63 R41.2
N$58
  Top 0.813: R40.1 46.99,22.38 Q4.1
N$59  (via drill 0.7)
  Top 0.813: Q3.1 35.24,27.62 v36.2,27.94
  Bottom 0.813: v36.2,27.94 37.97,27.94 R42.2
N$60  (via drill 0.7)
  Top 0.813: Q7.3 15.71,13.67 R45.2 v24.77,13.97 26.8,13.97 R38.1 | D1.A 37.9,8.69 41.27,12.06 v41.27,13.34 R41.1
  Bottom 0.813: v41.27,13.34 41.27,12.06 37.47,8.26 30.48,8.26 v24.77,13.97
N$61
  Top 0.813: TR3.P$1 48.77,14.61 R40.2
N$62
  Bottom 0.813: R43.1 53.98,18.41 | 53.98,18.41 54.61,17.78 C41.1 | TR3.P$2 51.44,18.41 53.98,18.41
N$63  (via drill 0.7)
  Top 0.813: C42.1 49.44,24.45 Q4.2 49.22,24.45 49.53,24.13 v49.53,22.86
  Bottom 0.813: v49.53,22.86 R44.2
N$64
  Top 0.813: Q6.3 48.95,28.11 C42.2
N$65
  Top 0.61: IC2.1 83.06,68.58 R96.2 78.87,70.99 78.11,71.75 78.11,76.2 79.38,77.47 C68.+
N$66  (via drill 0.7)
  Top 0.813: D3.C 6.99,18.21 R48.A 7.62,13.97 R45.1 13.21,15.74 13.34,15.88 v13.34,16.51 | v22.86,24.13 21.59,25.4 21.59,26.54 R34.1
  Bottom 0.813: C43.1 5.08,15.24 R48.A | 44.45,28.57 R86.2 44.45,27.3 43.18,26.04 | 43.18,26.04 43.18,23.36 R44.1 43.69,19.68 R55.1 | 43.18,26.04 41.27,26.04 39.37,24.13 v22.86,24.13 22.23,15.88 20.95,14.61 15.24,14.61 v13.34,16.51
N$67
  Top 0.813: Q6.1 46.67,33.47 R46.2
N$68  (via drill 0.7)
  Top 0.813: R46.1 40.64,34.29 v40.01,33.66
  Bottom 0.406: R42.1 22.99,30.61 11.43,19.05 11.43,7.62 26.04,7.62 27.3,6.35 X13.4
  Bottom 0.813: v40.01,33.66 38.1,31.75 R42.1
N$69  (via drill 0.7)
  Top 0.813: Q7.1 13.51,10.62 v13.34,10.79 | v19.05,12.7 19.05,10.29 R47.1
  Bottom 0.813: v13.34,10.79 17.14,10.79 v19.05,12.7
N$70
  Top 0.813: X13.3 24.77,8.89 | 24.77,8.89 23.5,10.16 R47.2 | D2.A 25.4,8.26 24.77,8.89
N$71
  Top 0.813: Q7.2 11.11,7.3 9.53,8.89 R48.S
N$72
  Top 0.813: TR3.P$4 61.59,19.68 62.23,20.32 62.23,22.73 R49.2 64.14,22.86 64.64,23.36 R50.1
N$73
  Top 0.813: R51.2 64.27,27.94 R50.2 71.62,26.16 MX2.3
N$74
  Top 0.61: R52.1 79.75,28.07 R53.2 78.61,29.21 75.56,29.21 74.3,27.94 MX2.2
N$75
  Top 0.61: R54.2 C45.2 | L6.1 87.8,24.17 R54.2 | R54.2 83.82,24 R52.2
N$76
  Top 0.61: C53.- 90.5,35.23 92.71,33.02 C44.1 94.39,29.4 L6.2
N$77
  Top 0.61: X7.1 88.67,16.51 C45.1
N$78
  Top 0.61: Q10.1 81.75,35.73 80.01,37.47 78.23,37.47 R73.2 77.34,37.59 75.56,39.37 75.56,40.97 C54.+ 75.36,40.77 R74.2
N$79
  Top 0.813: MX2.6 76.83,18.41 | 76.83,18.41 R56.2 | R58.2 76.83,18.41
N$80
  Top 0.813: TR4.P$3 66.04,16.51 71.12,11.43 TR4.P$2 76.83,11.43 | 76.83,11.43 R57.2 | R56.1 76.83,11.43
N$81
  Top 0.813: TR4.P$4 62.87,10.79 62.87,8.89 | 62.87,8.89 Q8.3 | R63.2 62.87,8.89
N$82
  Bottom 0.813: C46.1 TR4.P$1 68.45,16.51 R59.1
N$83
  Top 0.813: Q8.2 66.64,5.88 | 66.64,5.88 R60.2 | C47.2 68.35,7.6 66.64,5.88
N$84
  Top 0.813: 56.52,5.21 R62.2 61.24,5.21 Q8.1 | 56.52,5.21 53.7,5.21 C48.1 | R63.1 57.02,7.49 56.52,6.99 56.52,5.21
N$85
  Top 0.813: R61.2 72.39,7.21 C47.1
N$86
  Top 0.813: X8.1 C48.2
N$87
  Top 0.61: R68.1 11.13,53.47 11.35,53.26 | 11.35,53.26 Q9.3 | TR5.P$4 12.06,53.98 11.35,53.26
N$88
  Top 0.813: TR5.P$3 6.99,57.15 12.06,62.23 TR5.P$2 11.2,65.64 C49.2
N$89
  Top 0.61: C49.1 17.14,67.31 | 17.14,67.31 R66.1 | R64.1 16.51,66.67 17.14,67.31
N$90
  Top 0.61: R64.2 21.59,59.56 | 21.59,59.56 25.27,59.56 MX1.6 | R65.1 21.59,59.56
N$91
  Bottom 0.813: C52.1 7.39,61.83 | 7.39,61.83 8.89,60.33 R67.1 | 7.39,61.83 7.39,64.36 TR5.P$1
N$92
  Top 0.61: R69.1 6.35,50.67 | 6.35,50.67 R68.2 9.86,49.7 Q9.1 | C51.1 6.35,50.67
N$93
  Top 0.61: R71.1 21.59,51.84 C50.1
N$94
  Top 0.61: R70.1 16.28,52.98 C50.2 16.11,49.7 Q9.2
N$95
  Top 0.61: X9.1 7.62,44.22 C51.2
N$96
  Top 0.61: R72.2 84.96,34.91 | 84.96,34.91 Q10.2 | C53.+ 85.61,35.56 84.96,34.91
N$97
  Top 0.61: C56.- 95.58,40.31 97.16,38.73 97.16,36.96 R78.2
N$98
  Top 0.61: Q10.3 83.19,38.73 83.5,39.05 Q12.1 81.28,44.3 R75.1
N$99
  Top 0.406: 70.48,38.1 70.48,41.91 72.39,41.91 74.3,43.18 74.93,43.18
  Top 0.61: Q11.2 74.3,34.77 74.3,35.56 73.03,36.83 R74.1 71.25,37.97 70.48,38.1 | R75.2 79.5,47.12 78.74,46.35 78.74,43.18 74.93,43.18
N$100
  Top 0.61: Q11.1 74.12,32.22 73.03,31.11 69.72,31.11 R76.1 68.71,31.11 C55.+
N$101  (via drill 0.7)
  Top 0.61: IC2.8 90.81,68.58 v92.08,69.85 93.34,71.12 93.34,72.08 C67.+
  Bottom 0.61: R97.1 v92.08,69.85
N$102
  Top 0.61: C56.+ 94.31,43.51 90.81,40.01 89.41,40.01 R77.2 86.97,40.51 Q12.2
N$103  (via drill 0.7)
  Top 0.61: Q12.3 85.86,44.28 v86.83,45.25 C57.+ | R79.2 71.25,46.23 v71.12,46.35
  Bottom 0.61: v71.12,46.35 85.72,46.35 v86.83,45.25
N$104
  Top 0.61: R79.1 R80.2 66.17,40.13 64.77,38.73 63.17,38.73 C58.+
N$105
  Top 0.61: VOL.3 95.89,46.99 C57.- 91.44,47.32 91.44,49.53 90.4,50.57 C61.1
N$106
  Top 0.61: IC2.6 90.81,66.04 91.44,65.41 93.22,65.41 R82.1 95.89,62.73 R81.2
N$107
  Top 0.61: VOL.2 93.34,50.16 92.08,51.44 C59.-
N$108
  Top 0.61: R82.2 92.2,68.08 91.44,67.31 IC2.7 87,67.31 87,69.85 87.63,70.48 87.63,71.62 R95.1
N$109
  Top 0.61: C59.+ 95.08,58.75 R81.1
N$110
  Top 0.61: R83.1 81.28,66.67 81.92,66.04 | 81.92,66.04 IC2.3 85.72,66.04 87,64.77 87.63,64.77 | 87.63,64.77 IC2.5 | R84.2 87.63,64.77 | C60.+ 81.92,66.04
N$111  (via drill 0.7)
  Top 0.406: R85.1 63.5,54.61 | 63.5,54.61 63.5,53.03 C62.+ 66.04,52.7 67.31,53.98 IC3.5 | v52.7,54.61 63.5,54.61
  Bottom 0.406: R86.1 44.45,39.37 40.01,43.81 40.01,52.7 41.91,54.61 v52.7,54.61
N$112
  Top 0.61: R88.2 61.77,65.53 C63.-
N$113
  Top 0.61: JP3.2 C61.2
N$114
  Top 0.61: C63.+ R87.1 68.45,64.27 69.85,62.87 IC3.2
N$115  (via drill 0.7)
  Top 0.406: R87.2 71.25,69.59 R89.1
  Top 0.61: IC3.1 v71.12,62.87 71.12,65.28 R87.2 | D4.C 62.02,48.05 v63.5,49.53
  Bottom 0.61: v63.5,49.53 71.12,57.15 v71.12,62.87
N$116
  Top 0.406: IC3.6 68.58,56.52 69.85,57.78 72.39,57.78 73.03,58.42 73.03,67.31 73.66,67.94 73.66,69.72 R89.2
N$117
  Top 0.61: C68.- R98.1
N$118
  Top 0.61: D5.C 65.41,49.53 69.85,53.98 IC3.7
N$119  (via drill 0.7)
  Top 0.61: D4.A 63.5,44.66 | 63.5,44.66 D5.A 66.25,44.66 68.58,46.99 68.58,48.66 | 68.58,48.66 C65.1 | 68.58,48.66 68.58,50.16 69.22,50.8 | v71.12,50.8 73.53,50.8 R94.1 | IC4.3 60.33,40.01 63.5,43.18 63.5,44.66
  Top 0.813: 69.22,50.8 v71.12,50.8 | v52.07,83.19 56.31,83.19 D6.A
  Bottom 0.813: v71.12,50.8 69.22,50.8 66.04,47.62 60.33,47.62 60.33,74.93 v52.07,83.19
N$120
  Top 0.813: R90.2 54.61,94.61 IFGAIN.1
N$121
  Top 0.813: D6.C 56.52,87.63 58.42,89.53 58.42,90.58 C64.1 58.42,91.03 IFGAIN.2
N$122
  Top 0.61: C65.2 71.75,48.9 74.3,46.35 74.3,45.22 R91.2
N$123
  Top 0.61: IC4.2 60.33,38.73 60.33,37.47 IC4.1 55.73,34.72 D7.A
N$124
  Top 0.813: D7.C 55.04,31.11 R92.2 55.24,31.11 55.24,14.61 51.44,10.79 41.91,10.79 40.01,8.89 40.01,6.99 38.1,5.08 33.02,5.08 32.38,5.71 32.38,8.26 | D1.C 32.38,8.26 | 32.38,8.26 D2.C
N$125
  Top 0.406: R93.1 74.3,57.15 75.56,58.42 C66.+
N$126
  Top 0.61: IC4.7 51.44,38.73 51.44,40.01 IC4.6
N$127  (via drill 2.8)
  other vias: 2.54,2.54
N$128
  Top 0.61: IC2.2 85.72,67.31 85.72,69.22 85.09,69.85 85.09,71.62 R95.2 84.45,71.75 82.55,73.66 80.78,73.66 R96.1
N$129  (via drill 0.7)
  Top 0.61: R85.2 63.5,61.59 64.77,62.87 v66.04,62.87 67.94,62.87 68.58,62.23 IC3.3
  Bottom 0.61: JP3.1 81.28,60.33 77.47,64.14 67.31,64.14 v66.04,62.87
N$130  (via drill 2.8)
  other vias: 97.79,2.54
N$131  (via drill 2.8)
  other vias: 2.54,97.79
N$132  (via drill 2.8)
  other vias: 97.79,97.79
N$133
  Top 0.61: JP4.1 R98.2
N$135
  Top 0.406: R99.1 49.53,40.51 49.53,39.37 48.9,38.73 C27.+ 49.23,37.47 IC4.8